# Altium project MotorDriver_1R1.PrjPcb
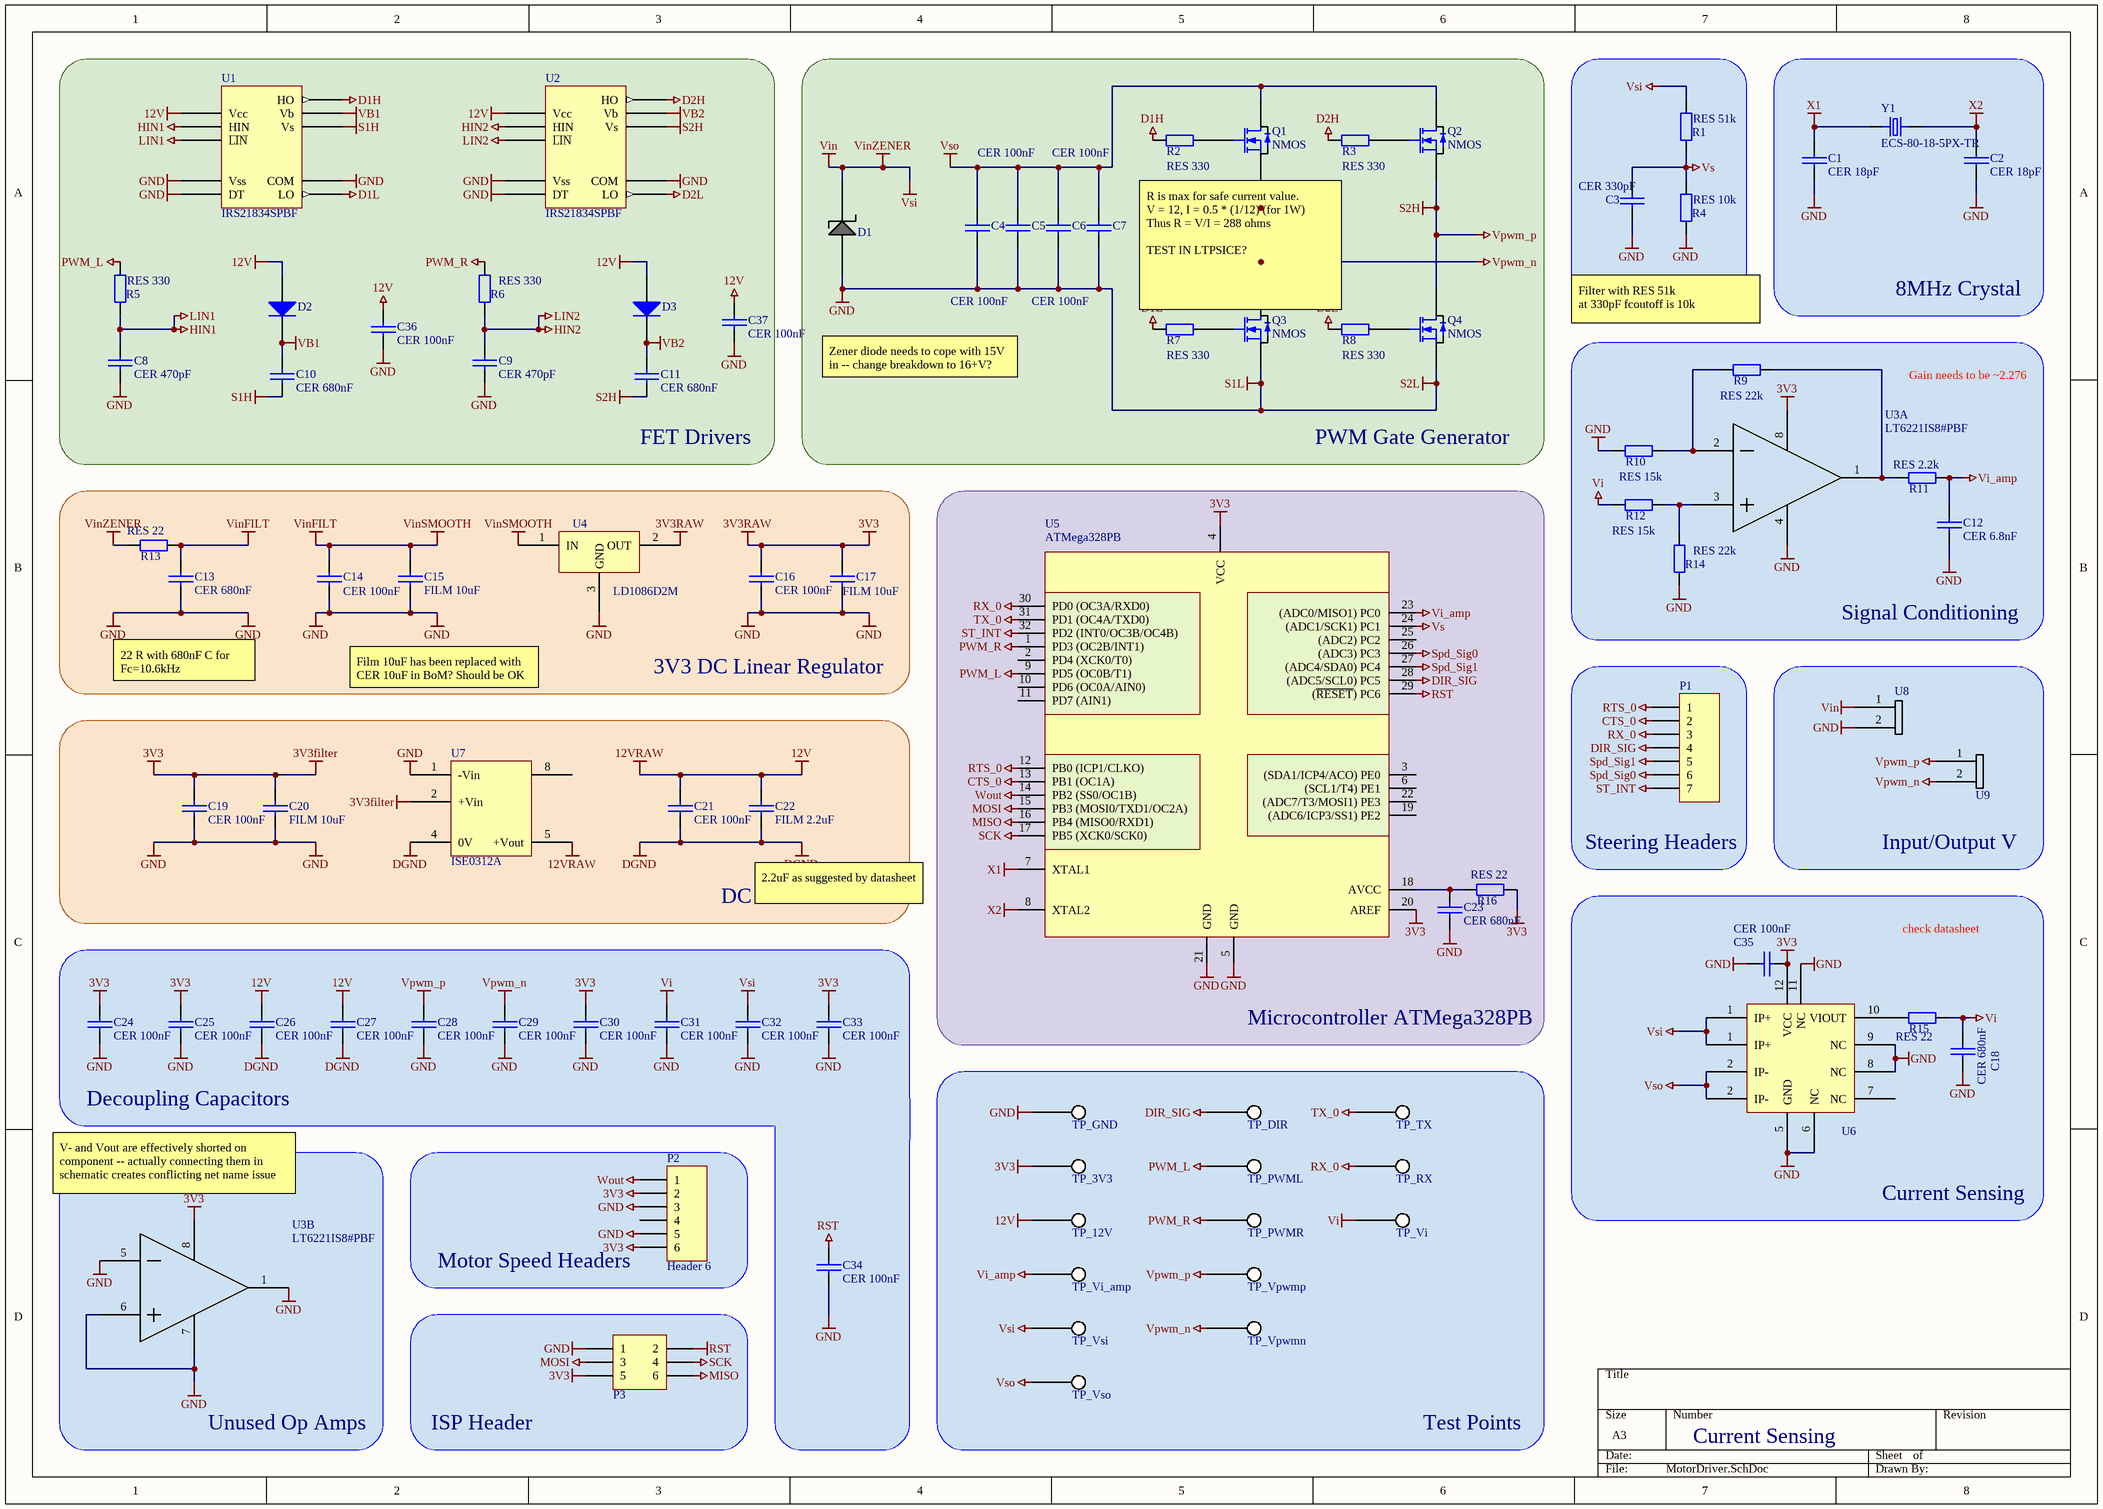
[diagram p0: MotorDriver.SchDoc]
1 sheet, 87 parts. Net scope: global (net labels, ports and power ports of the same name join across sheets).
Board files: MotorDriver.PcbDoc, MotorDriver_Final_V1.0.PcbDoc

## Sheet MotorDriver.SchDoc
size A3

### Parts
C1  CER 18pF  [C1210]
C2  CER 18pF  [C1210]
C3  CER 330pF  [C1206]
C4  CER 100nF  [C1206]
C5  CER 100nF  [C1206]
C6  CER 100nF  [C1206]
C7  CER 100nF  [C1206]
C8  CER 470pF  [C1210]
C9  CER 470pF  [C1210]
C10  CER 680nF  [C1206]
C11  CER 680nF  [C1206]
C12  CER 6.8nF  [C1206]
C13  CER 680nF  [C1206]
C14  CER 100nF  [C1206]
C15  FILM 10uF  [LDECE4150KA0N00]
C16  CER 100nF  [C1206]
C17  FILM 10uF  [LDECE4150KA0N00]
C18  CER 680nF  [C1206]
C19  CER 100nF  [C1206]
C20  FILM 10uF  [LDECE4150KA0N00]
C21  CER 100nF  [C1206]
C22  FILM 2.2uF  [LDECE4150KA0N00]
C23  CER 680nF  [C1206]
C24  CER 100nF  [C1206]
C25  CER 100nF  [C0805]
C26  CER 100nF  [C1206]
C27  CER 100nF  [C1206]
C28  CER 100nF  [C1206]
C29  CER 100nF  [C1206]
C30  CER 100nF  [C0805]
C31  CER 100nF  [C0805]
C32  CER 100nF  [C1206]
C33  CER 100nF  [C0805]
C34  CER 100nF  [C1206]
C35  CER 100nF  [C1206]
C36  CER 100nF  [C1206]
C37  CER 100nF  [C1206]
D1  DO-214AA SMB  [DO-214AA]  (value not drawn)
D2  MSS1P6-M3/89A  [MicroSMP (DO-219AD)]  (value not drawn)
D3  MSS1P6-M3/89A  [MicroSMP (DO-219AD)]  (value not drawn)
P1  Header 7  [HDR1X7]  (value not drawn)
P2  Header 6  [HDR1X6]
P3  HDR3X2  [HDR2X3_2P54]  (value not drawn)
Q1  NMOS  [BSC072N08NS5ATMA1_modified_v2]
Q2  NMOS  [BSC072N08NS5ATMA1_modified_v2]
Q3  NMOS  [BSC072N08NS5ATMA1_modified_v2]
Q4  NMOS  [BSC072N08NS5ATMA1_modified_v2]
R1  RES 51k  [R0805]
R2  RES 330  [R0805]
R3  RES 330  [R0805]
R4  RES 10k  [R0805]
R5  RES 330  [R0805]
R6  RES 330  [R0805]
R7  RES 330  [R0805]
R8  RES 330  [R0805]
R9  RES 22k  [R0805]
R10  RES 15k  [R0805]
R11  RES 2.2k  [R0805]
R12  RES 15k  [R0805]
R13  RES 22  [R0805]
R14  RES 22k  [R0805]
R15  RES 22  [R0805]
R16  RES 22  [R0805]
TP_3V3  TP_3V3  [TP5015]  (value not drawn)
TP_12V  TP_12V  [TP5015]  (value not drawn)
TP_DIR  TP_DIR  [TP5015]  (value not drawn)
TP_GND  TP_GND  [TP5015]  (value not drawn)
TP_PWML  TP_F/B  [TP5015]  (value not drawn)
TP_PWMR  TP_PWM  [TP5015]  (value not drawn)
TP_RX  TP_RX  [TP5015]  (value not drawn)
TP_TX  TP_TX  [TP5015]  (value not drawn)
TP_Vi  TP_Vi  [TP5015]  (value not drawn)
TP_Vi_amp  TP_Vi_amp  [TP5015]  (value not drawn)
TP_Vpwmn  TP_Vsi  [TP5015]  (value not drawn)
TP_Vpwmp  TP_Vi_amp  [TP5015]  (value not drawn)
TP_Vsi  TP_Vsi  [TP5015]  (value not drawn)
TP_Vso  TP_Vso  [TP5015]  (value not drawn)
U1  IRS21834SPBF  [SOIC127P600X175-14N]
U2  IRS21834SPBF  [SOIC127P600X175-14N]
U3  LT6221IS8#PBF  [SOIC8_NARROW]  (parts A,B of 2)
U4  LD1086D2M  [D2PAK-3L]
U5  ATMega328PB  [TQFP32]
U6  ACS70331EESATR-005U3  [ACS70331_12QFN]  (value not drawn)
U7  ISE0312A  [ISE0312A]
U8  2 PIN HEADER 3MM  [3mm_holes]  (value not drawn)
U9  2 PIN HEADER 3MM  [3mm_holes]  (value not drawn)
Y1  ECS-80-18-5PX-TR  [XTAL_ECS-80-18-5PX-TR]

### Blocks framed on the sheet
FET Drivers: C8-C11 C36 C37 D2 D3 R5 R6 U1 U2
PWM Gate Generator: C4-C7 D1 Q1-Q4 R2 R3 R7 R8
Voltage Sensing: C3 R1 R4
8MHz Crystal: C1 C2 Y1
Signal Conditioning: C12 R9-R12 R14 U3
3V3 DC Linear Regulator: C13-C17 R13 U4
Microcontroller ATMega328PB: C23 R16 U5
Steering Headers: P1
Input/Output V: U8 U9
DC 12V converter: C19-C22 U7
Current Sensing: C18 C35 R15 U6
Decoupling Capacitors: C24-C33
Test Points: TP_3V3 TP_12V TP_DIR TP_GND TP_PWML TP_PWMR TP_RX TP_TX TP_Vi TP_Vi_amp TP_Vpwmn TP_Vpwmp TP_Vsi TP_Vso
Unused Op Amps: U3
Motor Speed Headers: P2
ISP Header: P3

### Nets
3V3: C16.2 C17.2 C19.2 C20.2 C24.2 C25.2 C30.2 C33.2 C35.1 P2.2 P2.6 P3.5 R16.2 TP_3V3.1 U3.8 U4.2(OUT) U5.4(VCC) U5.20(AREF) U6.12(VCC) U7.2(+Vin)  [also labelled 3V3filter, 3V3RAW]
12V: C21.2 C22.2 C26.2 C27.2 C36.2 C37.2 D2.1(A) D3.1(A) TP_12V.1 U1.7(Vcc) U2.7(Vcc) U7.5(+Vout)  [also labelled 12VRAW]
CTS_0: P1.2 U5.13(PB1_(OC1A))
D1H: R2.1 U1.12(HO)
D1L: R7.1 U1.6(LO)
D2H: R3.1 U2.12(HO)
D2L: R8.1 U2.6(LO)
DGND: C21.1 C22.1 C26.1 C27.1 U7.4(0V)
DIR_SIG: P1.4 TP_DIR.1 U5.28((ADC5/SCL0)_PC5)
GND: C1.1 C2.1 C3.1 C4.1 C5.1 C6.1 C7.1 C8.1 C9.1 C12.1 C13.1 C14.1 C15.1 C16.1 C17.1 C18.1 C19.1 C20.1 C23.1 C24.1 C25.1 C28.1 C29.1 C30.1 C31.1 C32.1 C33.1 C34.1 C35.2 C36.1 C37.1 D1.2 P2.3 P2.5 P3.1 Q3.1(S) Q4.1(S) R4.1 R10.1 R14.1 TP_GND.1 U1.3(Vss) U1.4(DT) U1.5(COM) U2.3(Vss) U2.4(DT) U2.5(COM) U3.1 U3.4 U3.5 U3.6 U3.7 U4.3(GND) U5.5(GND) U5.21(GND) U6.5(GND) U6.6(NC) U6.8(NC) U6.9(NC) U6.11(NC) U7.1(-Vin) U8.2  [also labelled S1L, S2L]
HIN1: C8.2 R5.1 U1.1(HIN) U1.2(L̅I̅N̅)  [also labelled LIN1]
HIN2: C9.2 R6.1 U2.1(HIN) U2.2(L̅I̅N̅)  [also labelled LIN2]
MISO: P3.6 U5.16(PB4_(MISO0/RXD1))
MOSI: P3.3 U5.15(PB3_(MOSI0/TXD1/OC2A))
PWM_L: R5.2 TP_PWML.1 U5.9(PD5_(OC0B/T1))
PWM_R: R6.2 TP_PWMR.1 U5.1(PD3_(OC2B/INT1))
RST: C34.2 P3.2 U5.29((~{RESET})_PC6)
RTS_0: P1.1 U5.12(PB0_(ICP1/CLKO))
RX_0: P1.3 TP_RX.1 U5.30(PD0_(OC3A/RXD0))
S1H: C10.1 C29.2 Q1.1(S) Q3.8(D) TP_Vpwmn.1 U1.11(Vs) U9.2  [also labelled Vpwm_n]
S2H: C11.1 C28.2 Q2.1(S) Q4.8(D) TP_Vpwmp.1 U2.11(Vs) U9.1  [also labelled Vpwm_p]
SCK: P3.4 U5.17(PB5_(XCK0/SCK0))
Spd_Sig0: P1.6 U5.26((ADC3)_PC3)
Spd_Sig1: P1.5 U5.27((ADC4/SDA0)_PC4)
ST_INT: P1.7 U5.32(PD2_(INT0/OC3B/OC4B))
TX_0: TP_TX.1 U5.31(PD1_(OC4A/TXD0))
VB1: C10.2 D2.2(K) U1.13(Vb)
VB2: C11.2 D3.2(K) U2.13(Vb)
Vi: C18.2 C31.2 R12.1 R15.2 TP_Vi.1
Vi_amp: C12.2 R11.1 TP_Vi_amp.1 U5.23((ADC0/MISO1)_PC0)
Vin: C32.2 D1.1 R1.2 R13.1 TP_Vsi.1 U6.1(IP+) U8.1  [also labelled VinZENER, Vsi]
VinFILT: C13.2 C14.2 C15.2 R13.2 U4.1(IN)  [also labelled VinSMOOTH]
Vs: C3.2 R1.1 R4.2 U5.24((ADC1/SCK1)_PC1)
Vso: C4.2 C5.2 C6.2 C7.2 Q1.8(D) Q2.8(D) TP_Vso.1 U6.2(IP-)
Wout: P2.1 U5.14(PB2_(SS0/OC1B))
X1: C1.2 U5.7(XTAL1) Y1.1
X2: C2.2 U5.8(XTAL2) Y1.2
NetC23_2: C23.2 R16.1 U5.18(AVCC)
NetQ1_4: Q1.4(G) R2.2
NetQ2_4: Q2.4(G) R3.2
NetQ3_4: Q3.4(G) R7.2
NetQ4_4: Q4.4(G) R8.2
NetR9_1: R9.1 R10.2 U3.2
NetR9_2: R9.2 R11.2 U3.1
NetR12_2: R12.2 R14.2 U3.3
NetR15_1: R15.1 U6.10(VIOUT)

Not connected (* = marked no-connect by the designer): P2 4; U5 2(PD4_(XCK0/T0)) 3((SDA1/ICP4/ACO)_PE0) 6((SCL1/T4)_PE1) 10(PD6_(OC0A/AIN0)) 11(PD7_(AIN1)) 19((ADC6/ICP3/SS1)_PE2) 22((ADC7/T3/MOSI1)_PE3) 25((ADC2)_PC2); U6 7(NC); U7 8

### Notes on the sheet
- (near Q3) R is max for safe current value.
  V = 12, I = 0.5 * (1/12) (for 1W)
  Thus R = V/I = 288 ohms
  TEST IN LTPSICE?
- Filter with RES 51k
  at 330pF fcoutoff is 10k
- Zener diode needs to cope with 15V in -- change breakdown to 16+V?
- Gain needs to be ~2.276
- (near R13) Pin driver 2.5V @ 10mA thus Rmin of 250 ohm
  Q = I*t and Q = CV so t = C*V/I
  tideal is 1/2 of 1% of 30kHz, 167ns
  where I = 10mA and V = 2.5V thus
  Cmaxideal = 670pF
- 22 R with 680nF C for Fc=10.6kHz
- Film 10uF has been replaced with CER 10uF in BoM? Should be OK
- Bootstrap C >=  10x Cgs + Cgd
  Thus @10Vgd C = 10 * (2100p + 1000p)
  Cmin is 30nF
  This charges in t = 4.3us @ 12V and 1W
  Where 1% of 30kHz period is 0.33us
  However at Vds of 10V Cin is 2100pF but Cout jumps to 3600pF. Thus x10 Cin+Cout is 100nF, charge time of 30uS
  Duleepa told primary side to go larger though? They use 1uF, same MOSFETS + drivers, @150khz. Thus we use 680nF?
- (near C22) 2.2uF as suggested by datasheet
- check datasheet
- V- and Vout are effectively shorted on component -- actually connecting them in schematic creates conflicting net name issue
- Current Sensing

### Library data of the parts
C1-C3 C8 C9 C12-C14 C18 C19 C21 C23-C25 C28-C35 = CCAP0805: Type: Surface Mount; MPN: ?; Part Description: ?; Value: ?
C4-C7 C10 C11 C16 C26 C27 C36 C37 = Cap CER Decoup C3216C0G2A104J160AC: CAP CER 0.1UF 100V C0G 1206; Manufacturer: TDK Corporation; Type: Surface mount; Value: 100nF/100V; MPN: C3216C0G2A104J160AC; Part Description: CAP CER 0.1UF 100V C0G 1206; Supplier 1: RSComponents; Supplier Part Number 1: 1795799; Supplier 2: Element14; Supplier Part Number 4: 810-C3216C0G2A104J6C; Supplier Part Number 3: 445-172677-1-ND; Supplier Part Number 2: 2906828; Supplier 4: Mouser; Supplier 3: Digi-Key
C15 C17 C20 C22 = Cap Film SMD LDECE4150KA0N00: CAP FILM 1.5UF 10% 50VDC 2824; Manufacturer: KEMET; Type: Surface mount; Value: 1.5uF/50V; MPN: LDECE4150KA0N00; Supplier 1: Element14; Supplier 2: RSComponents; Part Description: CAP FILM 1.5UF 10% 50VDC 2824; Supplier Part Number 4: 80-LDECE4150KA0N00; Supplier Part Number 3: 399-12858-1-ND; Supplier Part Number 2: 1650342; Supplier Part Number 1: 2495712; Supplier 4: Mouser; Supplier 3: Digi-Key
D1 = SMBJ5351B-TP: 14V zener diode
D2 D3 = Diode MSS1P6-M3/89A: DIODE SCHOTTKY 60V 1A MICROSMP; Manufacturer: Vishay Semiconductor Diodes Division; Type: Surface mount; MPN: MSS1P6-M3/89A; Supplier 1: RSComponents; Supplier 2: Element14; Part Description: DIODE SCHOTTKY 60V 1A MICROSMP; Supplier Part Number 2: 2335157; Supplier Part Number 1: 7103070P
P1 = Header 7: Header, 7-Pin; LatestRevisionDate: 17-Jul-2002; LatestRevisionNote: Re-released for DXP Platform.; Publisher: Altium Limited
P2 = Header 6: Header, 6-Pin; LatestRevisionDate: 17-Jul-2002; LatestRevisionNote: Re-released for DXP Platform.; Publisher: Altium Limited
P3 = HDR3X2: Header, 3-Pin, Dual row
Q1-Q4 = NMOS OptiMOS BSC072N08NS5ATMA1: MOSFET N-CH 80V 74A 8TDSON; Manufacturer: Infineon Technologies; Type: Surface mount; MPN: BSC072N08NS5ATMA1; Supplier 1: Element14; Part Description: MOSFET N-CH 80V 74A 8TDSON; Supplier Part Number 3: 726-BSC072N08NS5ATMA; Supplier Part Number 1: 2725812; Supplier 3: Mouser; Supplier Part Number 2: BSC072N08NS5ATMA1CT-ND; Supplier 2: Digi-Key
R1-R16 = RES0805: MPN: ?; Value: ?; Part Description: ?; Type: Surface Mount
TP_3V3 TP_12V TP_DIR TP_GND TP_PWML TP_PWMR TP_RX TP_TX TP_Vi TP_Vi_amp TP_Vpwmn TP_Vpwmp TP_Vsi TP_Vso = TP_5015: SM Test Point 5015
U1 U2 = IRS21834SPBF: IC GATE DRVR HALF-BRIDGE 14SOIC
U4 = LD1086D2M33TR: 3.3V linear voltage regulator
U5 = ATMega328PB: IC MCU 8BIT 32KB FLASH 32TQFP; Supplier 1: Digi-Key; Supplier Part Number 1: ATMEGA328PB-AU-ND; Supplier 2: Digikey; Supplier Part Number 2: ATMEGA328PB-AU-ND
U6 = ACS70331_QFN: HIGH SENSITIVITY, 1 MHZ, GMR-BAS
U7 = ISE0312A_8-SMD_5L: 3V-12V DC DC converter
U8 U9 = HEADER_2PIN: 3MM HOLES
Y1 = ECS-80-18-5PX-TR: 8MHz Â±30ppm Crystal 18pF 60 Ohms HC-49/US; MF: ECS Inc.; SnapEDA_Link: https://www.snapeda.com/parts/ECS-80-18-5PX-TR/ECS%20Inc./view-part/470513/?ref=snap; Digi-Key_Purchase_URL: https://www.digikey.com/product-detail/en/ecs-inc/ECS-80-18-5PX-TR/XC1271CT-ND/827735?utm_source=snapeda&utm_medium=aggregator&utm_campaign=symbol; MP: ECS-80-18-5PX-TR; Digi-Key_Part_Number: XC1271CT-ND; Value: *; Package: HC49/US ECS International